# EAGLE design v1 (EAGLE 6.5.0)
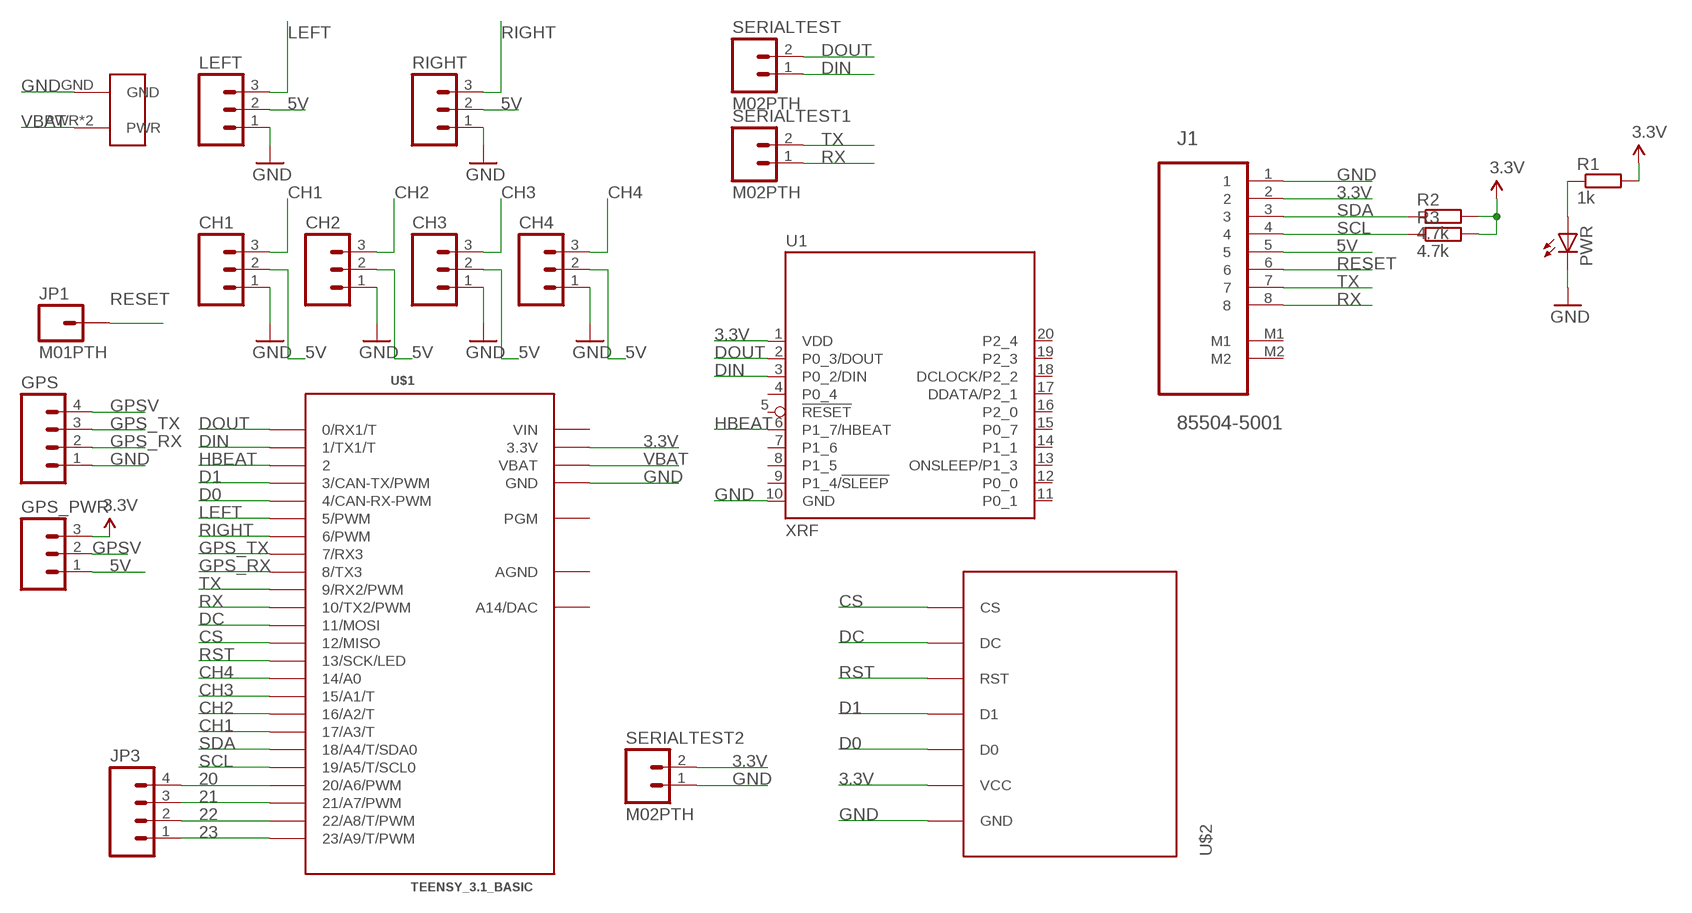
[diagram p0: schematic, sheet 1]

## Parts
CH1  M03PTH  [1X03]
CH2  M03PTH  [1X03]
CH3  M03PTH  [1X03]
CH4  M03PTH  [1X03]
GPS  M04PTH  [1X04]
GPS_PWR  M03PTH  [1X03]
J1  85504-5001  [MOLEX_85504-5001]
JP1  M01PTH  [1X01]
JP3  M04PTH  [1X04]
LEFT  M03PTH  [1X03]
PWR  LEDCHIPLED_0805  [CHIPLED_0805]
R1  1k  R-EU_R0805  [R0805]
R2  4.7k  R-EU_R0805  [R0805]
R3  4.7k  R-EU_R0805  [R0805]
RIGHT  M03PTH  [1X03]
SERIALTEST  M02PTH  [1X02]
SERIALTEST1  M02PTH  [1X02]
SERIALTEST2  M02PTH  [1X02]
U1  XRF  [XRF]
U$1  TEENSY_3.1_BASIC  [TEENSY_3.1_BASIC]
U$2  OLED_SSD1306_SPI  [OLED_SSD1306_SPI]
U$3  COINCELL  [COINCELL]

## Nets
3.3V: GPS_PWR.3 J1.2 R1.2 R2.2 R3.2 SERIALTEST2.2 U1.1(VDD) U$1.3.3V U$1.3.3V1(3.3V) U$2.VCC
5V: CH1.2 CH2.2 CH3.2 CH4.2 GPS_PWR.1 J1.5 LEFT.2 RIGHT.2
20: JP3.4 U$1.20/A6(20/A6/PWM)
21: JP3.3 U$1.21/A7(21/A7/PWM)
22: JP3.2 U$1.22/A8(22/A8/T/PWM)
23: JP3.1 U$1.23/A9(23/A9/T/PWM)
CH1: CH1.3 U$1.17/A3(17/A3/T)
CH2: CH2.3 U$1.16/A2(16/A2/T)
CH3: CH3.3 U$1.15/A1(15/A1/T)
CH4: CH4.3 U$1.14/A0
CS: U$1.12(12/MISO) U$2.CS
D0: U$1.4(4/CAN-RX-PWM) U$2.D0
D1: U$1.3(3/CAN-TX/PWM) U$2.D1
DC: U$1.11(11/MOSI) U$2.DC
DIN: SERIALTEST.1 U1.3(P0_2/DIN) U$1.1(1/TX1/T)
DOUT: SERIALTEST.2 U1.2(P0_3/DOUT) U$1.0(0/RX1/T)
GND: CH1.1 CH2.1 CH3.1 CH4.1 GPS.1 J1.1 LEFT.1 PWR.C RIGHT.1 SERIALTEST2.1 U1.10(GND) U$1.GND U$1.GND1(GND) U$2.GND U$3.GND
GPS_RX: GPS.2 U$1.8(8/TX3)
GPS_TX: GPS.3 U$1.7(7/RX3)
GPSV: GPS.4 GPS_PWR.2
HBEAT: U1.6(P1_7/HBEAT) U$1.2
LEFT: LEFT.3 U$1.5(5/PWM)
N$1: PWR.A R1.1
RESET: J1.6 JP1.1
RIGHT: RIGHT.3 U$1.6(6/PWM)
RST: U$1.13(13/SCK/LED) U$2.RST
RX: J1.8 SERIALTEST1.1 U$1.10(10/TX2/PWM)
SCL: J1.4 R3.1 U$1.19/A5(19/A5/T/SCL0)
SDA: J1.3 R2.1 U$1.18/A4(18/A4/T/SDA0)
TX: J1.7 SERIALTEST1.2 U$1.9(9/RX2/PWM)
VBAT: U$1.VBAT U$3.PWR U$3.PWR2(PWR)
Unconnected: J1.M1 J1.M2 U1.4(P0_4) U1.5(!RESET) U1.7(P1_6) U1.8(P1_5) U1.9(P1_4/!SLEEP) U1.11(P0_1) U1.12(P0_0) U1.13(ONSLEEP/P1_3) U1.14(P1_1) U1.15(P0_7) U1.16(P2_0) U1.17(DDATA/P2_1) U1.18(DCLOCK/P2_2) U1.19(P2_3) U1.20(P2_4) U$1.A14(A14/DAC) U$1.PGM

## Power pins joined to a net without a drawn wire
AGND: U$1.AGND
VIN: U$1.VIN

## Library data of the parts
CH1-CH4 GPS_PWR LEFT RIGHT = SparkFun-Connectors:M03: Header 3 Standard 3-pin 0.1" header. Use with straight break away headers (SKU : PRT-00116), right angle break away headers (PRT-00553), swiss pins (PRT-00743), machine pins (PRT-00117), and female headers (PRT-00115). Molex polarized connector foot print use with SKU : PRT-08232 with associated crimp pins and housings.
GPS JP3 = SparkFun-Connectors:M04: Header 4 Standard 4-pin 0.1" header. Use with straight break away headers (SKU : PRT-00116), right angle break away headers (PRT-00553), swiss pins (PRT-00743), machine pins (PRT-00117), and female headers (PRT-00115). Molex polarized connector foot print use with SKU : PRT-08231 with associated crimp pins and housings. 1MM SMD Version SKU: PRT-10208
J1 = Molex-8550x-xxxx:85504-5001: CONNECTOR, RJ45, JACK, 8P8C, 1PORT, CAT5; MPN: 85504-5001; OC_FARNELL: 2313732; OC_NEWARK: 96W3689; PACKAGE: RJ45, JACK, 8P8C; SUPPLIER: MOLEX
JP1 = SparkFun-Connectors:M01: Header 1 Standard 1-pin 0.1" header. Use with straight break away headers (SKU : PRT-00116), right angle break away headers (PRT-00553), swiss pins (PRT-00743), machine pins (PRT-00117), and female headers (PRT-00115).
PWR = led:LED: LED OSRAM: - CHIPLED LG R971, LG N971, LY N971, LG Q971, LY Q971, LO R971, LY R971 LH N974, LH R974 LS Q976, LO Q976, LY Q976 LO Q996 - Hyper CHIPLED LW Q18S LB Q993, LB Q99A, LB R99A - SideLED LS A670, LO A670, LY A670, LG A670, LP A670 LB A673, LV A673, LT A673, LW A673 LH A674 LY A675 LS A676, LA A676, LO A676, LY A676, LW A676 LS A679, LY A679, LG A679 - Hyper Micro SIDELED® LS Y876, LA Y876, LO Y876, LY Y876 LT Y87S - SmartLED LW L88C, LW L88S LB L89C, LB L89S, LG L890 LS L89K, LO L89K, LY L89K LS L896, LA L896, LO L896, LY L896 - TOPLED LS T670, LO T670, LY T670, LG T670, LP T670 LSG T670, LSP T670, LSY T670, LOP T670, LYG T670 LG T671, LOG T671, LSG T671 LB T673, LV T673, LT T673, LW T673 LH T674 LS T676, LA T676, LO T676, LY T676, LB T676, LH T676, LSB T676, LW T676 LB T67C, LV T67C, LT T67C, LS T67K, LO T67K, LY T67K, LW E67C LS E67B, LA E67B, LO E67B, LY E67B, LB E67C, LV E67C, LT E67C LW T67C LS T679, LY T679, LG T679 LS T770, LO T770, LY T770, LG T770, LP T770 LB T773, LV T773, LT T773, LW T773 LH T774 LS E675, LA E675, LY E675, LS T675 LS T776, LA T776, LO T776, LY T776, LB T776 LHGB T686 LT T68C, LB T68C - Hyper Mini TOPLED® LB M676 - Mini TOPLED Santana® LG M470 LS M47K, LO M47K, LY M47K Source: http://www.osram.convergy.de LUXEON: - LUMILED® LXK2-PW12-R00, LXK2-PW12-S00, LXK2-PW14-U00, LXK2-PW14-V00 LXK2-PM12-R00, LXK2-PM12-S00, LXK2-PM14-U00 LXK2-PE12-Q00, LXK2-PE12-R00, LXK2-PE12-S00, LXK2-PE14-T00, LXK2-PE14-U00 LXK2-PB12-K00, LXK2-PB12-L00, LXK2-PB12-M00, LXK2-PB14-N00, LXK2-PB14-P00, LXK2-PB14-Q00 LXK2-PR12-L00, LXK2-PR12-M00, LXK2-PR14-Q00, LXK2-PR14-R00 LXK2-PD12-Q00, LXK2-PD12-R00, LXK2-PD12-S00 LXK2-PH12-R00, LXK2-PH12-S00 LXK2-PL12-P00, LXK2-PL12-Q00, LXK2-PL12-R00 Source: www.luxeon.com KINGBRIGHT: KA-3528ASYC Source: www.kingbright.com
R1-R3 = rcl:R-EU_: RESISTOR, European symbol
SERIALTEST SERIALTEST1 SERIALTEST2 = SparkFun-Connectors:M02: Standard 2-pin 0.1" header. Use with - straight break away headers ( PRT-00116) - right angle break away headers (PRT-00553) - swiss pins (PRT-00743) - machine pins (PRT-00117) - female headers (PRT-00115) Molex polarized connector foot print use with: PRT-08233 with associated crimp pins and housings. 2.54_SCREWTERM for use with PRT-10571. 3.5mm Screw Terminal footprints for PRT-08084 5mm Screw Terminal footprints for use with PRT-08433
U1 = Ciseco Footprints:XRF: XRF Wireless UART Serial Data Module. www.ciseco.co.uk
U$1 = Teensy_3_Series_Board_v1.0:TEENSY_3.1_BASIC: Footprint for Teensy 3.1 board using all pin connections on the outer perimeter
U$2 = hobby-components:OLED_SSD1306_SPI: OLED DISPLAY MODULE SSD1306 128X64 PIXEL http://forum.hobbycomponents.com/viewtopic.php?f=39&t=1517
U$3 = Steve:COINCELL

## Board
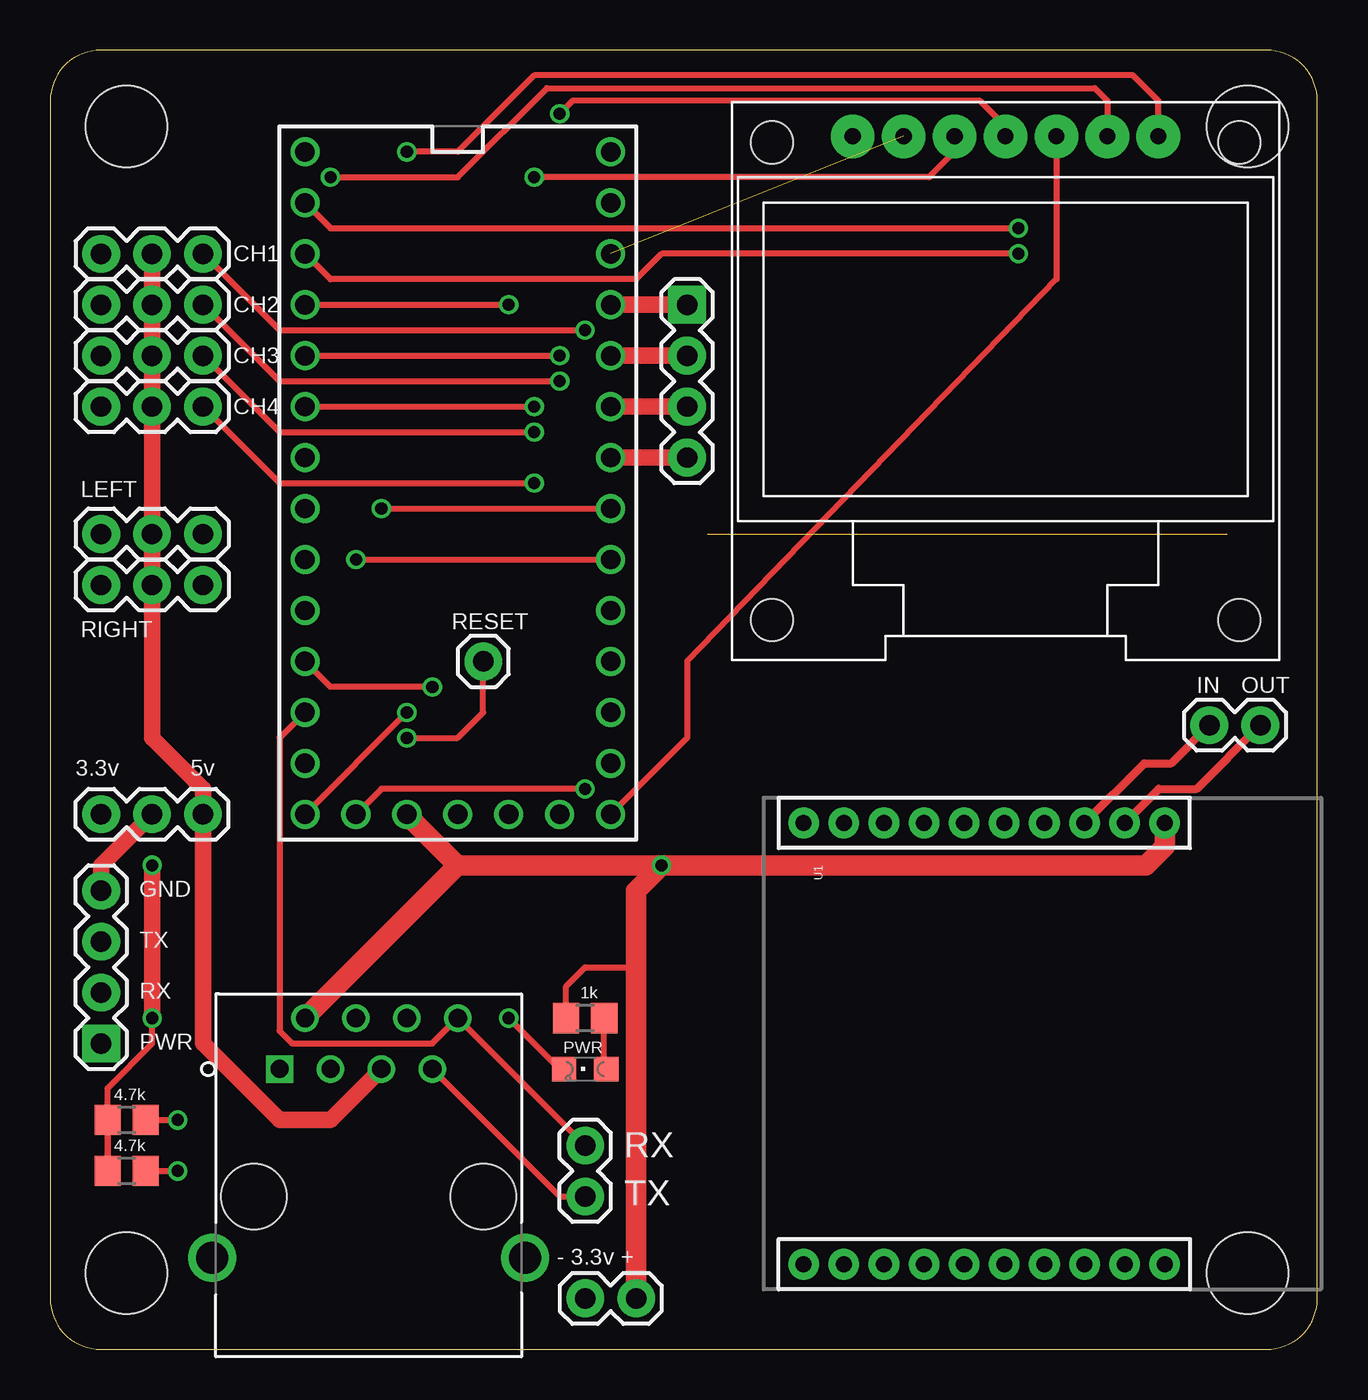
[diagram p1: board, top side]
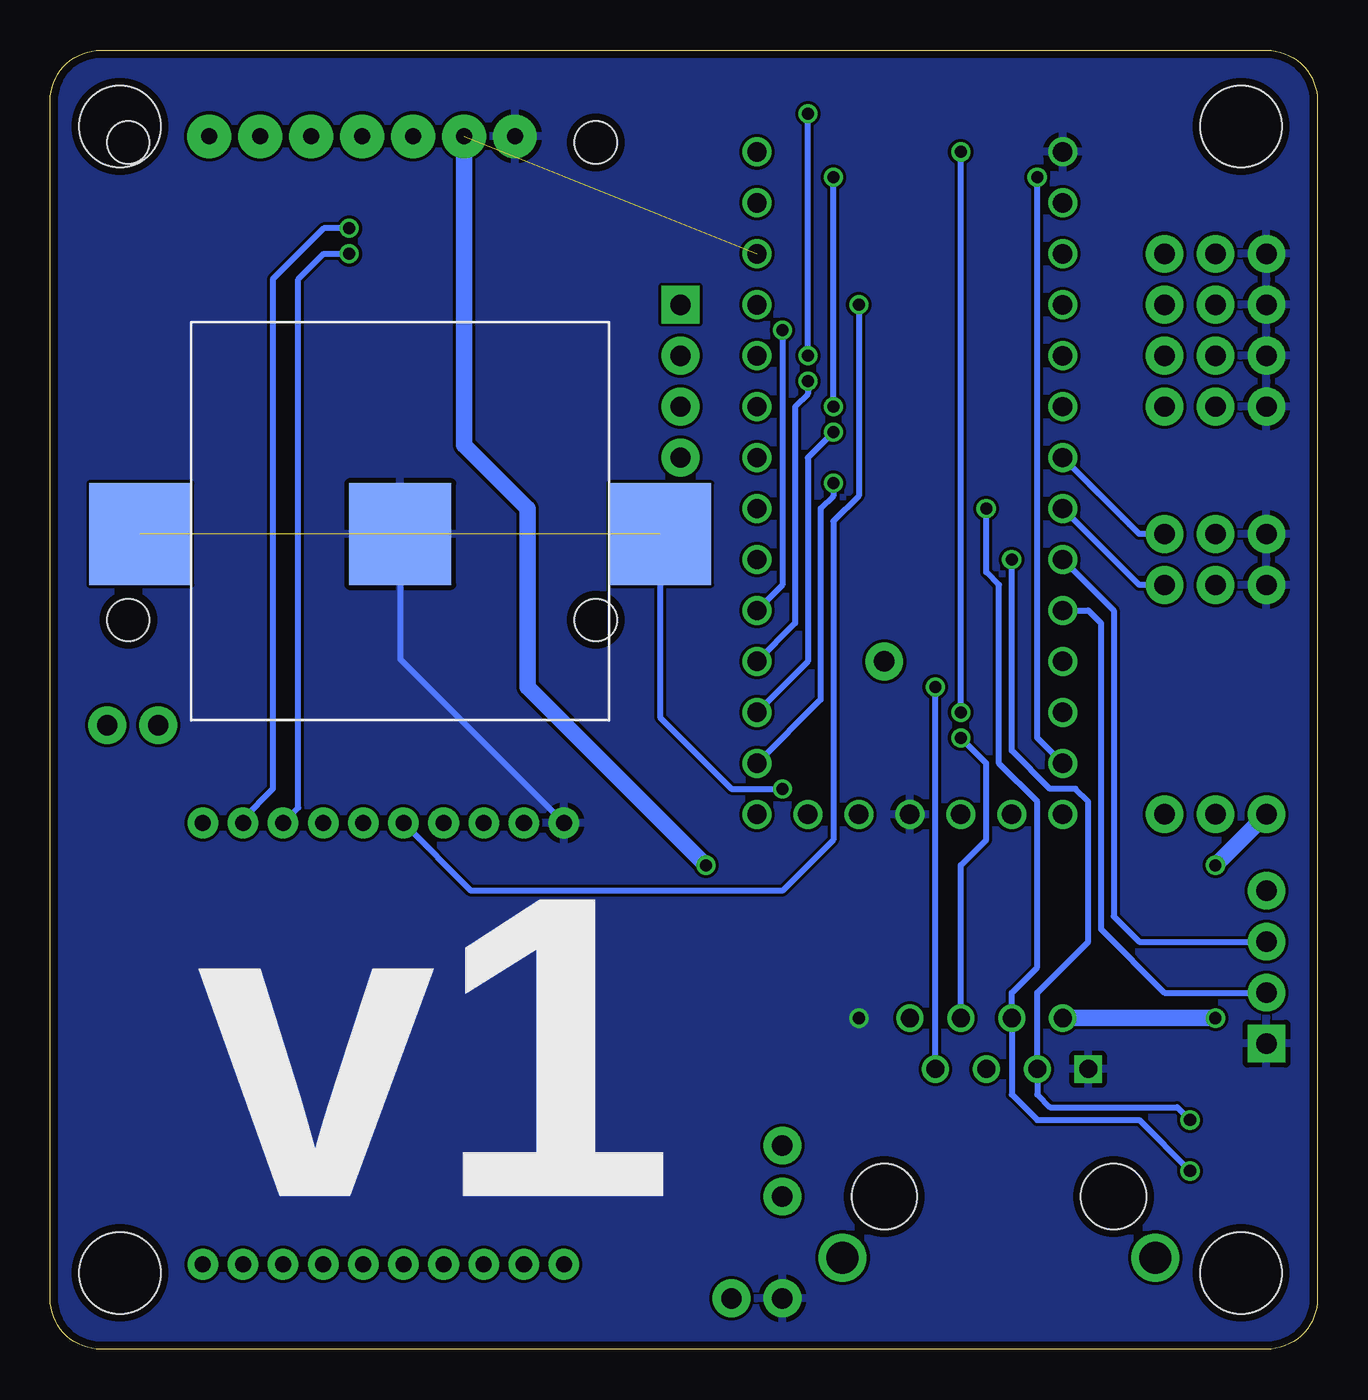
[diagram p2: board, bottom side, seen from below]

Size 63.17 x 64.76 mm. Coordinates in mm from the lower left corner, seen from the top.
Outline: 0,62.22 0,2.54 arc90 2.54,0 60.63,0 arc90 63.17,2.54 63.17,62.22 arc90 60.63,64.76 2.54,64.76 arc90 0,62.22
Copper layers (1*16): Top 0.0356mm / dielectric 1.5011mm / Bottom 0.0356mm
Design rules "LaenPCBOrder": minimum track width 6mil, minimum drill 13mil, track to track 6mil, track to pad 6mil, pad to pad 6mil, via to via 6mil, smd to smd 6mil, copper to edge 15mil, drill to drill 6mil, minimum pad ring 7mil, minimum via ring 7mil, stop-mask expansion 3mil, vias tented up to drill 0mil, thermal gap 10mil
Holes 4.06 mm at 3.81,3.81 3.81,60.96 59.69,60.96 59.69,3.81

### Footprints (pad centres in the part's own frame; a part is rotated, then mirrored left to right if it is on the bottom)
1X03 = drill 1.016 pad 1.88: 1 0,0; 2 2.54,0; 3 5.08,0
1X04 = drill 1.016 pad 1.88 square: 1 0,0 | drill 1.016 pad 1.88: 2 2.54,0; 3 5.08,0; 4 7.62,0
MOLEX_85504-5001 = drill 0.9 square: 1 0,0 | drill 0.9: 2 1.27,2.54; 3 2.54,0; 4 3.81,2.54; 5 5.08,0; 6 6.35,2.54; 7 7.62,0; 8 8.89,2.54 | drill 1.6: M1 -3.35,-9.4; M2 12.24,-9.4 | hole 3.25: -1.27,-6.35; 10.16,-6.35
1X01 = drill 1.016 pad 1.88: 1 0,0
CHIPLED_0805 = smd 1.2 x 1.2: A 0,-1.05; C 0,1.05
R0805 = smd 1.3 x 1.5: 1 -0.95,0; 2 0.95,0
1X02 = drill 1.016 pad 1.88: 1 0,0; 2 2.54,0
XRF = drill 0.8 pad 1.524: 1 -11,20; 2 -11,18; 3 -11,16; 4 -11,14; 5 -11,12; 6 -11,10; 7 -11,8; 8 -11,6; 9 -11,4; 10 -11,2; 11 11,2; 12 11,4; 13 11,6; 14 11,8; 15 11,10; 16 11,12; 17 11,14; 18 11,16; 19 11,18; 20 11,20
TEENSY_3.1_BASIC = drill 0.965: 0 -7.62,13.97; 1 -7.62,11.43; 2 -7.62,8.89; 3 -7.62,6.35; 3.3V 7.62,11.43; 3.3V1 -2.54,-16.51; 4 -7.62,3.81; 5 -7.62,1.27; 6 -7.62,-1.27; 7 -7.62,-3.81; 8 -7.62,-6.35; 9 -7.62,-8.89; 10 -7.62,-11.43; 11 -7.62,-13.97; 12 -7.62,-16.51; 13 7.62,-16.51; 14/A0 7.62,-13.97; 15/A1 7.62,-11.43; 16/A2 7.62,-8.89; 17/A3 7.62,-6.35; 18/A4 7.62,-3.81; 19/A5 7.62,-1.27; 20/A6 7.62,1.27; 21/A7 7.62,3.81; 22/A8 7.62,6.35; 23/A9 7.62,8.89; A14 5.08,-16.51; AGND 7.62,13.97; GND -7.62,16.51; GND1 0,-16.51; PGM 2.54,-16.51; VBAT -5.08,-16.51; VIN 7.62,16.51
OLED_SSD1306_SPI = drill 0.8 pad 2.184: CS 7.62,12.2; D0 -2.54,12.2; D1 0,12.2; DC 5.08,12.2; GND -7.62,12.2; RST 2.54,12.2; VCC -5.08,12.2 | hole 2.1: 11.65,11.9; -11.65,11.9; -11.65,-11.9; 11.65,-11.9
COINCELL = smd 5.08 x 5.08: GND 0,0; PWR -12.954,0; PWR2 12.954,0

### Placement (x,y rotation side)
CH1  2.54,54.61 0 top
CH2  2.54,52.07 0 top
CH3  2.54,49.53 0 top
CH4  2.54,46.99 0 top
GPS  2.54,15.24 90 top
GPS_PWR  7.62,26.67 180 top
J1  11.43,13.97 0 top
JP1  21.59,34.29 0 top
JP3  31.75,52.07 270 top
LEFT  2.54,40.64 0 top
PWR  26.67,13.97 90 top
R1  26.67,16.51 180 top
R2  3.81,11.43 180 top
R3  3.81,8.89 180 top
RIGHT  2.54,38.1 0 top
SERIALTEST  57.78,31.11 0 top
SERIALTEST1  26.67,10.16 270 top
SERIALTEST2  26.67,2.54 0 top
U1  35.56,15.24 270 top
U$1  20.32,43.18 0 top
U$2  47.62,48.26 0 top
U$3  45.72,40.64 180 bottom

### Tracks (layer width: path | path; a pad name or v marks a point on that pad's centre or on a via)
3.3V  (via drill 0.6)  (1 unrouted)
  Top 0.305: R2.2 R3.2 2.86,13.02 5.08,15.24 v5.08,16.51 | R1.2 25.72,18.1 26.67,19.05 29.21,19.05
  Top 0.813: v5.08,24.13 v5.08,16.51
  Top 1.016: U1.1 55.56,25.08 54.61,24.13 v30.48,24.13 | v30.48,24.13 20.32,24.13 | 20.32,24.13 J1.2 | U$1.3.3V1 20.32,24.13 | SERIALTEST2.2 29.21,19.05 29.21,22.86 v30.48,24.13
  Bottom 0.813: v5.08,16.51 J1.2 | U$2.VCC 42.55,45.09 39.37,41.91 39.37,33.02 v30.48,24.13 | GPS_PWR.3 v5.08,24.13
5V
  Top 0.813: CH1.2 CH2.2 CH3.2 CH4.2 LEFT.2 RIGHT.2 5.08,30.48 7.62,27.94 GPS_PWR.1 7.62,15.24 11.43,11.43 13.97,11.43 J1.5
20
  Top 0.813: U$1.20/A6 JP3.4
21
  Top 0.813: U$1.21/A7 JP3.3
22
  Top 0.813: U$1.22/A8 JP3.2
23
  Top 0.813: U$1.23/A9 JP3.1
CH1  (via drill 0.6)
  Top 0.305: CH1.3 11.43,50.8 v26.67,50.8
  Bottom 0.305: v26.67,50.8 26.67,38.1 U$1.17/A3
CH2  (via drill 0.6)
  Top 0.305: CH2.3 11.43,48.26 v25.4,48.26
  Bottom 0.305: v25.4,48.26 25.4,47.62 26.04,46.99 26.04,36.2 U$1.16/A2
CH3  (via drill 0.6)
  Top 0.305: CH3.3 11.43,45.72 v24.13,45.72
  Bottom 0.305: v24.13,45.72 25.4,44.45 25.4,34.29 U$1.15/A1
CH4  (via drill 0.6)
  Top 0.305: CH4.3 11.43,43.18 v24.13,43.18
  Bottom 0.305: v24.13,43.18 24.13,42.55 24.77,41.91 24.77,32.38 U$1.14/A0
CS  (via drill 0.6)
  Top 0.305: U$1.12 v17.78,31.75 | U$2.CS 55.24,62.23 53.98,63.5 24.13,63.5 20.32,59.69 v17.78,59.69
  Bottom 0.305: v17.78,31.75 v17.78,59.69
D0  (via drill 0.6)
  Top 0.305: U$1.4 v24.13,46.99 | U$2.D0 45.09,59.69 43.81,58.42 v24.13,58.42
  Bottom 0.305: v24.13,46.99 v24.13,58.42
D1  (via drill 0.6)
  Top 0.305: U$1.3 v25.4,49.53 | U$2.D1 47.62,60.96 46.35,62.23 26.04,62.23 v25.4,61.59
  Bottom 0.305: v25.4,49.53 v25.4,61.59
DC  (via drill 0.6)
  Top 0.305: v13.97,58.42 20.32,58.42 24.77,62.87 52.07,62.87 52.7,62.23 U$2.DC
  Bottom 0.305: U$1.11 13.97,30.48 v13.97,58.42
DIN  (via drill 0.6)
  Top 0.305: U$1.1 13.97,53.34 29.21,53.34 30.48,54.61 v48.26,54.61
  Top 0.406: U1.3 54.53,29.21 55.88,29.21 SERIALTEST.1
  Bottom 0.305: U1.3 50.8,27 50.8,53.34 49.53,54.61 v48.26,54.61
DOUT  (via drill 0.6)
  Top 0.305: U$1.0 13.97,55.88 v48.26,55.88
  Top 0.406: U1.2 55.26,27.94 57.15,27.94 SERIALTEST.2
  Bottom 0.305: v48.26,55.88 49.53,55.88 52.07,53.34 52.07,27.94 53.56,26.45 U1.2
GND  (via drill 0.6)
  Top 0.305: 25.4,13.97 v22.86,16.51
  Top 0.406: PWR.C 25.4,13.97
  Bottom 0.305: U$3.GND 45.72,34.4 U1.10
  pour Bottom: 0,64.77 63.5,64.77 63.5,0 0,0
GPS_RX
  Bottom 0.305: U$1.8 11.43,36.83 10.79,36.2 10.79,20.95 7.62,17.78 GPS.2
GPS_TX
  Bottom 0.305: U$1.7 10.16,36.83 10.16,21.59 8.89,20.32 GPS.3
GPSV
  Top 0.813: GPS_PWR.2 2.54,24.13 GPS.4
HBEAT  (via drill 0.6)
  Top 0.305: U$1.2 v22.86,52.07
  Bottom 0.305: v22.86,52.07 22.86,42.55 24.13,41.27 24.13,25.4 26.67,22.86 42.18,22.86 U1.6
LEFT
  Bottom 0.305: LEFT.3 8.89,40.64 U$1.5
N$1
  Top 0.305: PWR.A 27.62,14.07 R1.1
RESET  (via drill 0.6)
  Top 0.305: v17.78,30.48 20.32,30.48 21.59,31.75 JP1.1
  Bottom 0.305: J1.6 17.78,24.13 16.51,25.4 16.51,29.21 v17.78,30.48
RIGHT
  Bottom 0.305: U$1.6 8.89,38.1 RIGHT.3
RST
  Top 0.305: U$1.13 31.75,30.48 31.75,34.29 50.16,53.34 U$2.RST
RX
  Top 0.305: SERIALTEST1.1 J1.8 19.05,15.24 12.06,15.24 11.43,15.88 11.43,30.48 U$1.10
SCL  (via drill 0.6)
  Top 0.305: v16.51,41.91 U$1.19/A5 | R3.1 v6.35,8.89
  Bottom 0.305: v16.51,41.91 16.51,38.73 15.88,38.1 15.88,29.21 13.97,27.3 13.97,19.05 15.24,17.78 J1.4 15.24,12.7 13.97,11.43 8.89,11.43 v6.35,8.89
SDA  (via drill 0.6)
  Top 0.305: v15.24,39.37 U$1.18/A4 | R2.1 v6.35,11.43
  Bottom 0.305: v6.35,11.43 6.99,12.06 13.34,12.06 13.97,12.7 J1.3 13.97,17.78 11.43,20.32 11.43,27.3 12.06,27.94 13.34,27.94 15.24,29.84 v15.24,39.37
TX  (via drill 0.6)
  Top 0.305: J1.7 25.4,7.62 SERIALTEST1.2 | v19.05,33.02 13.97,33.02 U$1.9
  Bottom 0.305: J1.7 v19.05,33.02
VBAT  (via drill 0.6)  (1 unrouted)
  Top 0.305: v26.67,27.94 16.51,27.94 U$1.VBAT
  Bottom 0.305: U$3.PWR 32.77,31.5 29.21,27.94 v26.67,27.94

### Text on the board
_tsilk: RESET | IN | OUT | 3.3v | 5v | GND | TX | RX | PWR | RX | TX | - 3.3v +
_bsilk: v1